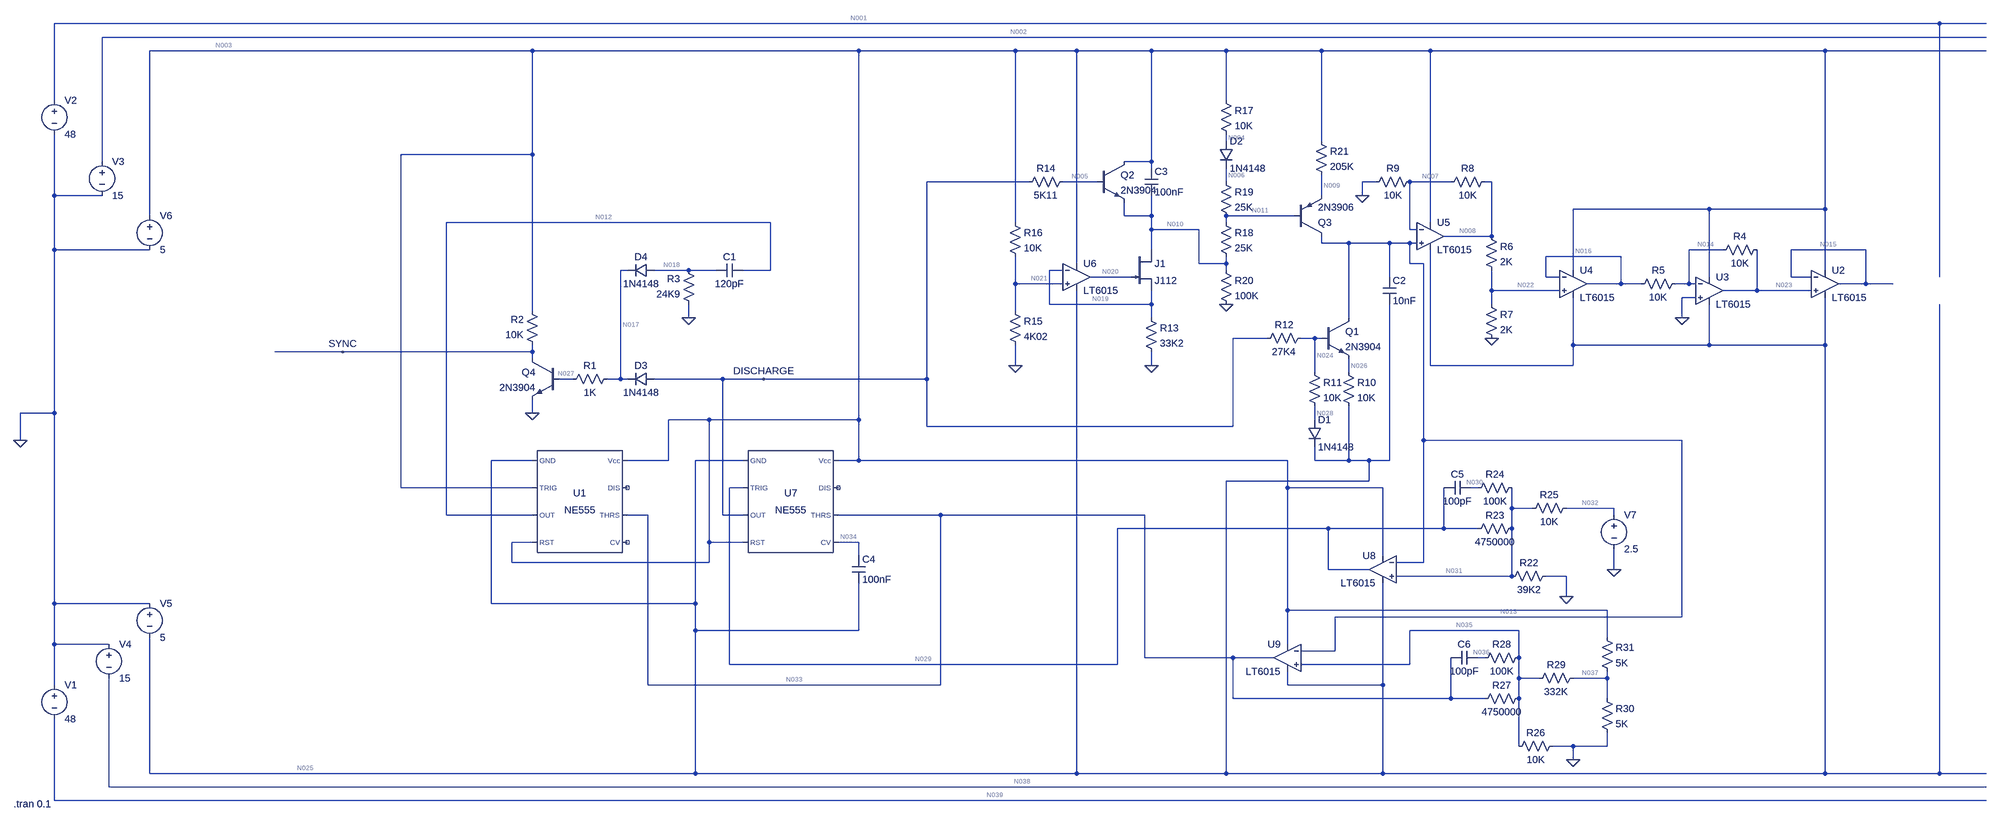
[diagram p0: schematic SWEEPGEN.asc]
SWEEPGEN.asc, the LTspice schematic file:
Version 4.1
SHEET 1 5972 680
WIRE 5328 -1472 48 -1472
WIRE 5968 -1472 5328 -1472
WIRE 5968 -1440 160 -1440
WIRE 1920 -1408 272 -1408
WIRE 2688 -1408 1920 -1408
WIRE 3056 -1408 2688 -1408
WIRE 3200 -1408 3056 -1408
WIRE 3376 -1408 3200 -1408
WIRE 3552 -1408 3376 -1408
WIRE 3776 -1408 3552 -1408
WIRE 4032 -1408 3776 -1408
WIRE 4960 -1408 4032 -1408
WIRE 5968 -1408 4960 -1408
WIRE 48 -1280 48 -1472
WIRE 3552 -1280 3552 -1408
WIRE 3552 -1184 3552 -1200
WIRE 3776 -1184 3776 -1408
WIRE 1920 -1152 1920 -1408
WIRE 1920 -1152 1536 -1152
WIRE 160 -1136 160 -1440
WIRE 3376 -1136 3376 -1408
WIRE 3376 -1136 3312 -1136
WIRE 3376 -1120 3376 -1136
WIRE 3088 -1088 2848 -1088
WIRE 3248 -1088 3168 -1088
WIRE 3552 -1088 3552 -1120
WIRE 3904 -1088 3872 -1088
WIRE 4080 -1088 3984 -1088
WIRE 4176 -1088 4160 -1088
WIRE 48 -1056 48 -1200
WIRE 160 -1056 48 -1056
WIRE 3776 -1056 3776 -1104
WIRE 3872 -1056 3872 -1088
WIRE 4688 -1024 4368 -1024
WIRE 4960 -1024 4960 -1408
WIRE 4960 -1024 4688 -1024
WIRE 272 -1008 272 -1408
WIRE 3312 -1008 3312 -1040
WIRE 3376 -1008 3376 -1056
WIRE 3376 -1008 3312 -1008
WIRE 3712 -1008 3552 -1008
WIRE 2480 -992 1696 -992
WIRE 3056 -992 3056 -1408
WIRE 3552 -992 3552 -1008
WIRE 4032 -992 4032 -1408
WIRE 3376 -976 3376 -1008
WIRE 3488 -976 3376 -976
WIRE 3984 -976 3984 -1088
WIRE 4000 -976 3984 -976
WIRE 4176 -960 4176 -1088
WIRE 4176 -960 4064 -960
WIRE 3776 -944 3776 -960
WIRE 3840 -944 3776 -944
WIRE 3936 -944 3840 -944
WIRE 3984 -944 3936 -944
WIRE 4000 -944 3984 -944
WIRE 48 -928 48 -1056
WIRE 272 -928 48 -928
WIRE 3376 -928 3376 -976
WIRE 4720 -928 4640 -928
WIRE 5056 -928 4880 -928
WIRE 4480 -912 4304 -912
WIRE 3200 -896 3200 -1408
WIRE 3488 -896 3488 -976
WIRE 3552 -896 3552 -912
WIRE 3552 -896 3488 -896
WIRE 3984 -896 3984 -944
WIRE 4016 -896 3984 -896
WIRE 2144 -880 2128 -880
WIRE 2288 -880 2208 -880
WIRE 2352 -880 2288 -880
WIRE 2480 -880 2480 -992
WIRE 2480 -880 2416 -880
WIRE 3168 -880 3136 -880
WIRE 3552 -880 3552 -896
WIRE 4368 -880 4368 -1024
WIRE 4960 -880 4960 -1024
WIRE 3328 -864 3232 -864
WIRE 3936 -864 3936 -944
WIRE 4304 -864 4304 -912
WIRE 4336 -864 4304 -864
WIRE 4688 -864 4688 -1024
WIRE 4880 -864 4880 -928
WIRE 4928 -864 4880 -864
WIRE 5328 -864 5328 -1472
WIRE 3056 -848 3056 -912
WIRE 3168 -848 3056 -848
WIRE 4480 -848 4480 -912
WIRE 4480 -848 4400 -848
WIRE 4528 -848 4480 -848
WIRE 4640 -848 4640 -928
WIRE 4640 -848 4608 -848
WIRE 4656 -848 4640 -848
WIRE 5056 -848 5056 -928
WIRE 5056 -848 4992 -848
WIRE 5120 -848 5056 -848
WIRE 4176 -832 4176 -880
WIRE 4336 -832 4176 -832
WIRE 4800 -832 4800 -928
WIRE 4800 -832 4720 -832
WIRE 4928 -832 4800 -832
WIRE 4656 -816 4624 -816
WIRE 3136 -800 3136 -880
WIRE 3376 -800 3376 -832
WIRE 3376 -800 3136 -800
WIRE 4176 -800 4176 -832
WIRE 1920 -784 1920 -1152
WIRE 3056 -784 3056 -848
WIRE 2288 -768 2288 -800
WIRE 3376 -768 3376 -800
WIRE 3840 -768 3840 -944
WIRE 4624 -768 4624 -816
WIRE 3648 -720 3568 -720
WIRE 3760 -720 3728 -720
WIRE 3776 -720 3760 -720
WIRE 4368 -704 4368 -816
WIRE 4688 -704 4688 -800
WIRE 4688 -704 4368 -704
WIRE 4960 -704 4960 -816
WIRE 4960 -704 4688 -704
WIRE 1376 -688 1216 -688
WIRE 1920 -688 1920 -704
WIRE 1920 -688 1376 -688
WIRE 1920 -672 1920 -688
WIRE 3056 -656 3056 -704
WIRE 3376 -656 3376 -688
WIRE 4032 -656 4032 -928
WIRE 4368 -656 4368 -704
WIRE 4368 -656 4032 -656
WIRE 3760 -640 3760 -720
WIRE 3840 -640 3840 -672
WIRE 2016 -624 1984 -624
WIRE 2128 -624 2128 -880
WIRE 2128 -624 2096 -624
WIRE 2144 -624 2128 -624
WIRE 2368 -624 2208 -624
WIRE 2464 -624 2368 -624
WIRE 2848 -624 2848 -1088
WIRE 2848 -624 2464 -624
WIRE 48 -544 48 -928
WIRE 48 -544 -32 -544
WIRE 1920 -544 1920 -576
WIRE 2336 -528 2240 -528
WIRE 2688 -528 2688 -1408
WIRE 2688 -528 2336 -528
WIRE 3760 -528 3760 -560
WIRE 2848 -512 2848 -624
WIRE 3568 -512 3568 -720
WIRE 3568 -512 2848 -512
WIRE -32 -480 -32 -544
WIRE 4016 -480 4016 -896
WIRE 4624 -480 4016 -480
WIRE 1920 -432 1824 -432
WIRE 2240 -432 2240 -528
WIRE 2240 -432 2144 -432
WIRE 2416 -432 2304 -432
WIRE 2688 -432 2688 -528
WIRE 2688 -432 2640 -432
WIRE 3696 -432 2688 -432
WIRE 3760 -432 3760 -464
WIRE 3840 -432 3840 -560
WIRE 3840 -432 3760 -432
WIRE 3888 -432 3840 -432
WIRE 3936 -432 3936 -800
WIRE 3936 -432 3888 -432
WIRE 3888 -384 3888 -432
WIRE 3888 -384 3552 -384
WIRE 1536 -368 1536 -1152
WIRE 1920 -368 1536 -368
WIRE 2416 -368 2384 -368
WIRE 3696 -368 3696 -432
WIRE 3920 -368 3696 -368
WIRE 4144 -368 4128 -368
WIRE 4224 -320 4224 -368
WIRE 4272 -320 4224 -320
WIRE 4464 -320 4352 -320
WIRE 1696 -304 1696 -992
WIRE 1920 -304 1696 -304
WIRE 2192 -304 2144 -304
WIRE 2368 -304 2368 -624
WIRE 2416 -304 2368 -304
WIRE 2880 -304 2640 -304
WIRE 3360 -304 2880 -304
WIRE 4464 -304 4464 -320
WIRE 3792 -272 3296 -272
WIRE 4064 -272 4064 -368
WIRE 4064 -272 3792 -272
WIRE 4144 -272 4064 -272
WIRE 4224 -272 4224 -320
WIRE 1920 -240 1872 -240
WIRE 2336 -240 2336 -528
WIRE 2416 -240 2336 -240
WIRE 2688 -240 2640 -240
WIRE 2688 -208 2688 -240
WIRE 3920 -208 3920 -368
WIRE 1872 -192 1872 -240
WIRE 2336 -192 2336 -240
WIRE 2336 -192 1872 -192
WIRE 4016 -192 4016 -480
WIRE 4016 -192 3952 -192
WIRE 3792 -176 3792 -272
WIRE 3888 -176 3792 -176
WIRE 4464 -176 4464 -224
WIRE 4224 -160 4224 -272
WIRE 4224 -160 3952 -160
WIRE 4352 -160 4304 -160
WIRE 4352 -112 4352 -160
WIRE 48 -96 48 -544
WIRE 272 -96 48 -96
WIRE 1824 -96 1824 -432
WIRE 2304 -96 2304 -432
WIRE 2304 -96 1824 -96
WIRE 3696 -80 3696 -368
WIRE 4448 -80 3696 -80
WIRE 4624 -64 4624 -480
WIRE 4624 -64 3808 -64
WIRE 2304 -32 2304 -96
WIRE 2688 -32 2688 -144
WIRE 2688 -32 2304 -32
WIRE 4240 -32 3984 -32
WIRE 4448 -16 4448 -80
WIRE 48 0 48 -96
WIRE 176 0 48 0
WIRE 3696 0 3696 -80
WIRE 3808 16 3808 -64
WIRE 3808 16 3728 16
WIRE 3360 32 3360 -304
WIRE 3568 32 3360 32
WIRE 3664 32 3568 32
WIRE 4160 32 4144 32
WIRE 4240 32 4240 -32
WIRE 2384 48 2384 -368
WIRE 3296 48 3296 -272
WIRE 3296 48 2384 48
WIRE 3984 48 3984 -32
WIRE 3984 48 3728 48
WIRE 4240 80 4240 32
WIRE 4288 80 4240 80
WIRE 4448 80 4448 64
WIRE 4448 80 4368 80
WIRE 48 96 48 0
WIRE 2192 96 2192 -304
WIRE 2880 96 2880 -304
WIRE 2880 96 2192 96
WIRE 3696 96 3696 64
WIRE 3920 96 3920 -144
WIRE 3920 96 3696 96
WIRE 3568 128 3568 32
WIRE 4080 128 4080 32
WIRE 4080 128 3568 128
WIRE 4160 128 4080 128
WIRE 4240 128 4240 80
WIRE 4448 128 4448 80
WIRE 4240 240 4240 128
WIRE 4368 240 4320 240
WIRE 4448 240 4448 208
WIRE 4448 240 4368 240
WIRE 4368 272 4368 240
WIRE 272 304 272 -16
WIRE 2304 304 2304 -32
WIRE 2304 304 272 304
WIRE 3200 304 3200 -832
WIRE 3200 304 2304 304
WIRE 3552 304 3552 -384
WIRE 3552 304 3200 304
WIRE 3920 304 3920 96
WIRE 3920 304 3552 304
WIRE 4960 304 4960 -704
WIRE 4960 304 3920 304
WIRE 5328 304 5328 -800
WIRE 5328 304 4960 304
WIRE 5968 304 5328 304
WIRE 176 336 176 80
WIRE 5968 336 176 336
WIRE 48 368 48 176
WIRE 5968 368 48 368
FLAG -32 -480 0
FLAG 4624 -768 0
FLAG 4176 -720 0
FLAG 3872 -1056 0
FLAG 3376 -656 0
FLAG 3056 -656 0
FLAG 3552 -800 0
FLAG 4352 -112 0
FLAG 4368 272 0
FLAG 4464 -176 0
FLAG 1920 -544 0
FLAG 2288 -768 0
FLAG 1376 -688 SYNC
FLAG 2464 -624 DISCHARGE
SYMBOL voltage 48 80 R0
SYMATTR InstName V1
SYMATTR Value 48
SYMBOL voltage 48 -1296 R0
SYMATTR InstName V2
SYMATTR Value 48
SYMBOL voltage 160 -1152 R0
SYMATTR InstName V3
SYMATTR Value 15
SYMBOL voltage 176 -16 R0
SYMATTR InstName V4
SYMATTR Value 15
SYMBOL voltage 272 -112 R0
SYMATTR InstName V5
SYMATTR Value 5
SYMBOL voltage 272 -1024 R0
SYMATTR InstName V6
SYMATTR Value 5
SYMBOL OpAmps\\LT6015 4960 -848 R0
SYMATTR InstName U2
SYMBOL OpAmps\\LT6015 4688 -832 R0
SYMATTR InstName U3
SYMBOL OpAmps\\LT6015 4368 -848 R0
SYMATTR InstName U4
SYMBOL res 4816 -944 R90
WINDOW 0 0 56 VBottom 2
WINDOW 3 32 56 VTop 2
SYMATTR InstName R4
SYMATTR Value 10K
SYMBOL res 4624 -864 R90
WINDOW 0 0 56 VBottom 2
WINDOW 3 32 56 VTop 2
SYMATTR InstName R5
SYMATTR Value 10K
SYMBOL res 4160 -976 R0
SYMATTR InstName R6
SYMATTR Value 2K
SYMBOL res 4160 -816 R0
SYMATTR InstName R7
SYMATTR Value 2K
SYMBOL OpAmps\\LT6015 4032 -960 R0
SYMATTR InstName U5
SYMBOL res 4176 -1104 R90
WINDOW 0 0 56 VBottom 2
WINDOW 3 32 56 VTop 2
SYMATTR InstName R8
SYMATTR Value 10K
SYMBOL res 4000 -1104 R90
WINDOW 0 0 56 VBottom 2
WINDOW 3 32 56 VTop 2
SYMATTR InstName R9
SYMATTR Value 10K
SYMBOL cap 3920 -864 R0
SYMATTR InstName C2
SYMATTR Value 10nF
SYMBOL res 3824 -656 R0
SYMATTR InstName R10
SYMATTR Value 10K
SYMBOL res 3744 -656 R0
SYMATTR InstName R11
SYMATTR Value 10K
SYMBOL res 3744 -736 R90
WINDOW 0 0 56 VBottom 2
WINDOW 3 32 56 VTop 2
SYMATTR InstName R12
SYMATTR Value 27K4
SYMBOL diode 3744 -528 R0
SYMATTR InstName D1
SYMATTR Value 1N4148
SYMBOL npn 3776 -768 R0
SYMATTR InstName Q1
SYMATTR Value 2N3904
SYMBOL npn 3248 -1136 R0
SYMATTR InstName Q2
SYMATTR Value 2N3904
SYMBOL njf 3328 -928 R0
SYMATTR InstName J1
SYMATTR Value J112
SYMBOL OpAmps\\LT6015 3200 -864 R0
SYMATTR InstName U6
SYMBOL res 3360 -784 R0
SYMATTR InstName R13
SYMATTR Value 33K2
SYMBOL cap 3360 -1120 R0
SYMATTR InstName C3
SYMATTR Value 100nF
SYMBOL res 3184 -1104 R90
WINDOW 0 0 56 VBottom 2
WINDOW 3 32 56 VTop 2
SYMATTR InstName R14
SYMATTR Value 5K11
SYMBOL res 3040 -800 R0
SYMATTR InstName R15
SYMATTR Value 4K02
SYMBOL res 3040 -1008 R0
SYMATTR InstName R16
SYMATTR Value 10K
SYMBOL res 3536 -1296 R0
SYMATTR InstName R17
SYMATTR Value 10K
SYMBOL res 3536 -1008 R0
SYMATTR InstName R18
SYMATTR Value 25K
SYMBOL diode 3536 -1184 R0
SYMATTR InstName D2
SYMATTR Value 1N4148
SYMBOL res 3536 -1104 R0
SYMATTR InstName R19
SYMATTR Value 25K
SYMBOL res 3536 -896 R0
SYMATTR InstName R20
SYMATTR Value 100K
SYMBOL res 3760 -1200 R0
SYMATTR InstName R21
SYMATTR Value 205K
SYMBOL pnp 3712 -960 M180
SYMATTR InstName Q3
SYMATTR Value 2N3906
SYMBOL Misc\\NE555 2528 -336 R0
SYMATTR InstName U7
SYMBOL cap 2672 -208 R0
SYMATTR InstName C4
SYMATTR Value 100nF
SYMBOL OpAmps\\LT6015 3920 -176 M0
SYMATTR InstName U8
SYMBOL OpAmps\\LT6015 3696 32 M0
SYMATTR InstName U9
SYMBOL res 4320 -176 R90
WINDOW 0 0 56 VBottom 2
WINDOW 3 32 56 VTop 2
SYMATTR InstName R22
SYMATTR Value 39K2
SYMBOL res 4240 -288 R90
WINDOW 0 0 56 VBottom 2
WINDOW 3 32 56 VTop 2
SYMATTR InstName R23
SYMATTR Value 4750000
SYMBOL res 4240 -384 R90
WINDOW 0 0 56 VBottom 2
WINDOW 3 32 56 VTop 2
SYMATTR InstName R24
SYMATTR Value 100K
SYMBOL cap 4128 -384 R90
WINDOW 0 0 32 VBottom 2
WINDOW 3 32 32 VTop 2
SYMATTR InstName C5
SYMATTR Value 100pF
SYMBOL res 4368 -336 R90
WINDOW 0 0 56 VBottom 2
WINDOW 3 32 56 VTop 2
SYMATTR InstName R25
SYMATTR Value 10K
SYMBOL res 4336 224 R90
WINDOW 0 0 56 VBottom 2
WINDOW 3 32 56 VTop 2
SYMATTR InstName R26
SYMATTR Value 10K
SYMBOL res 4256 112 R90
WINDOW 0 0 56 VBottom 2
WINDOW 3 32 56 VTop 2
SYMATTR InstName R27
SYMATTR Value 4750000
SYMBOL res 4256 16 R90
WINDOW 0 0 56 VBottom 2
WINDOW 3 32 56 VTop 2
SYMATTR InstName R28
SYMATTR Value 100K
SYMBOL cap 4144 16 R90
WINDOW 0 0 32 VBottom 2
WINDOW 3 32 32 VTop 2
SYMATTR InstName C6
SYMATTR Value 100pF
SYMBOL res 4384 64 R90
WINDOW 0 0 56 VBottom 2
WINDOW 3 32 56 VTop 2
SYMATTR InstName R29
SYMATTR Value 332K
SYMBOL res 4432 112 R0
SYMATTR InstName R30
SYMATTR Value 5K
SYMBOL res 4432 -32 R0
SYMATTR InstName R31
SYMATTR Value 5K
SYMBOL voltage 4464 -320 R0
SYMATTR InstName V7
SYMATTR Value 2.5
SYMBOL diode 2208 -640 R90
WINDOW 0 0 32 VBottom 2
WINDOW 3 32 32 VTop 2
SYMATTR InstName D3
SYMATTR Value 1N4148
SYMBOL res 2112 -640 R90
WINDOW 0 0 56 VBottom 2
WINDOW 3 32 56 VTop 2
SYMATTR InstName R1
SYMATTR Value 1K
SYMBOL res 1936 -688 R180
WINDOW 0 36 76 Left 2
WINDOW 3 36 40 Left 2
SYMATTR InstName R2
SYMATTR Value 10K
SYMBOL npn 1984 -672 M0
SYMATTR InstName Q4
SYMATTR Value 2N3904
SYMBOL diode 2208 -896 R90
WINDOW 0 0 32 VBottom 2
WINDOW 3 32 32 VTop 2
SYMATTR InstName D4
SYMATTR Value 1N4148
SYMBOL res 2304 -784 R180
WINDOW 0 36 76 Left 2
WINDOW 3 36 40 Left 2
SYMATTR InstName R3
SYMATTR Value 24K9
SYMBOL cap 2416 -896 R90
WINDOW 0 0 32 VBottom 2
WINDOW 3 32 32 VTop 2
SYMATTR InstName C1
SYMATTR Value 120pF
SYMBOL Misc\\NE555 2032 -336 R0
SYMATTR InstName U1
TEXT -48 376 Left 2 !.tran 0.1

The netlist it stands for:
* SWEEPGEN.asc
V1 0 N039 48
V2 N001 0 48
V3 N002 0 15
V4 0 N038 15
V5 0 N025 5
V6 N003 0 5
X§U2 N023 N015 N003 N025 N015 LT6016  ; LT6015, pins In+ In- V+ V- OUT
X§U3 0 N014 N003 N025 N023 LT6016  ; LT6015, pins In+ In- V+ V- OUT
X§U4 N022 N016 N003 N025 N016 LT6016  ; LT6015, pins In+ In- V+ V- OUT
R4 N023 N014 10K
R5 N014 N016 10K
R6 N008 N022 2K
R7 N022 0 2K
X§U5 N013 N007 N003 N025 N008 LT6016  ; LT6015, pins In+ In- V+ V- OUT
R8 N008 N007 10K
R9 N007 0 10K
C2 N013 N025 10nF
R10 N026 N025 10K
R11 N024 N028 10K
R12 N024 DISCHARGE 27K4
D1 N028 N025 1N4148
Q1 N013 N024 N026 0 2N3904
Q2 N003 N005 N010 0 2N3904
J1 N010 N020 N019 J112
X§U6 N021 N019 N003 N025 N020 LT6016  ; LT6015, pins In+ In- V+ V- OUT
R13 N019 0 33K2
C3 N003 N010 100nF
R14 N005 DISCHARGE 5K11
R15 N021 0 4K02
R16 N003 N021 10K
R17 N003 N004 10K
R18 N011 N010 25K
D2 N004 N006 1N4148
R19 N006 N011 25K
R20 N010 0 100K
R21 N003 N009 205K
Q3 N013 N011 N009 0 2N3906
X§U7 N025 N029 DISCHARGE N003 N034 N033 NC_01 N003 NE555  ; pins GND TRIG OUT RST CV THRS DIS Vcc
C4 N034 N025 100nF
X§U8 N031 N013 N003 N025 N029 LT6016  ; LT6015, pins In+ In- V+ V- OUT
X§U9 N035 N013 N003 N025 N033 LT6016  ; LT6015, pins In+ In- V+ V- OUT
R22 0 N031 39K2
R23 N031 N029 4750000
R24 N031 N030 100K
C5 N030 N029 100pF
R25 N032 N031 10K
R26 0 N035 10K
R27 N035 N033 4750000
R28 N035 N036 100K
C6 N036 N033 100pF
R29 N037 N035 332K
R30 N037 0 5K
R31 N003 N037 5K
V7 N032 0 2.5
D3 DISCHARGE N017 1N4148
R1 N017 N027 1K
R2 SYNC N003 10K
Q4 SYNC N027 0 0 2N3904
D4 N018 N017 1N4148
R3 0 N018 24K9
C1 N012 N018 120pF
X§U1 N025 N003 N012 N003 NC_02 N033 NC_03 N003 NE555  ; pins GND TRIG OUT RST CV THRS DIS Vcc
.model D D
.lib standard.dio
.model NPN NPN
.model PNP PNP
.lib standard.bjt
.model NJF NJF
.model PJF PJF
.lib standard.jft
.tran 0.1
.lib LTC2.lib
.lib NE555.sub
.backanno
.end

* Results of the author's LTspice run, read from the files saved beside the schematic
* Operating Point, zero values left out:
*   V(n001) = 48 V
*   V(n025) = -5 V
*   V(n022) = -2.438 V
*   V(n013) = -3.616 V
*   V(discharge) = 4.977 V
*   V(n021) = 1.434 V
*   V(n006) = 4.614 V
*   V(n030) = 1.996 V
*   V(n036) = 81.62 mV
*   V(n027) = 801 mV
*   V(n038) = -15 V
*   V(n023) = 2.438 V
*   V(n008) = -4.876 V
*   V(n026) = -3.622 V
*   V(n010) = 4.385 V
*   V(n011) = 4.5 V
*   V(n029) = 4.568 V
*   V(n035) = 81.62 mV
*   V(n017) = 4.334 V
*   V(n018) = 62.86 µV
*   V(n033) = 4.568 V
*   V(n039) = -48 V
*   V(n003) = 5 V
*   V(n014) = -649.1 nV
*   V(n007) = -2.438 V
*   V(n028) = -4.501 V
*   V(n005) = 4.976 V
*   V(n019) = 1.434 V
*   V(n009) = 4.941 V
*   V(n032) = 2.5 V
*   V(sync) = 7.249 mV
*   V(n034) = 1.667 V
*   V(n002) = 15 V
*   V(n015) = 2.438 V
*   V(n016) = -2.438 V
*   V(n024) = -2.974 V
*   V(n020) = -537.8 mV
*   V(n004) = 4.954 V
*   V(n031) = 1.996 V
*   V(n037) = 2.482 V
*   V(n012) = 5 V
*   I(R2) = -499.3 µA
*   I(R8) = -243.8 µA
*   I(R4) = 243.8 µA
*   I(D2) = 4.579 µA
*   I(V6) = -13.23 mA
*   I(R20) = 43.85 µA
*   I(R12) = -290.2 µA
*   I(R25) = 50.39 µA
*   I(V7) = -50.39 µA
*   I(R16) = 356.6 µA
*   Ic(Q1) = 330.7 nA
*   Ib(Q1) = 137.5 µA
*   Ie(Q1) = -137.8 µA
*   I(D4) = -2.524 nA
*   I(R6) = -1.219 mA
*   I(R29) = 7.23 µA
*   I(R23) = -541.4 nA
*   I(R18) = 4.58 µA
*   I(V5) = -9.714 mA
*   I(R27) = -944.4 nA
*   Ic(Q3) = -284.1 nA
*   Ib(Q3) = -1.306 nA
*   Ie(Q3) = 285.4 nA
*   I(R1) = 3.533 mA
*   I(R15) = 356.6 µA
*   I(R11) = 152.7 µA
*   I(R19) = 4.579 µA
*   Id(J1) = 43.19 µA
*   Ig(J1) = -14.5 pA
*   Is(J1) = -43.19 µA
*   I(R31) = 503.6 µA
*   I(R5) = 243.8 µA
*   I(R13) = 43.18 µA
*   I(R9) = -243.8 µA
*   I(D1) = 152.7 µA
*   Ic(Q4) = 499.3 µA
*   Ib(Q4) = 3.533 mA
*   Ie(Q4) = -4.032 mA
*   I(R26) = -8.162 µA
*   I(D3) = 3.533 mA
*   I(R22) = -50.92 µA
*   I(R21) = 285.4 nA
*   I(R17) = 4.579 µA
*   I(R30) = 496.4 µA
*   I(R3) = -2.524 nA
*   I(R7) = -1.219 mA
*   Ic(Q2) = 82.18 µA
*   Ib(Q2) = 273.9 nA
*   Ie(Q2) = -82.46 µA
*   I(R14) = -273.9 nA
*   I(R10) = 137.8 µA